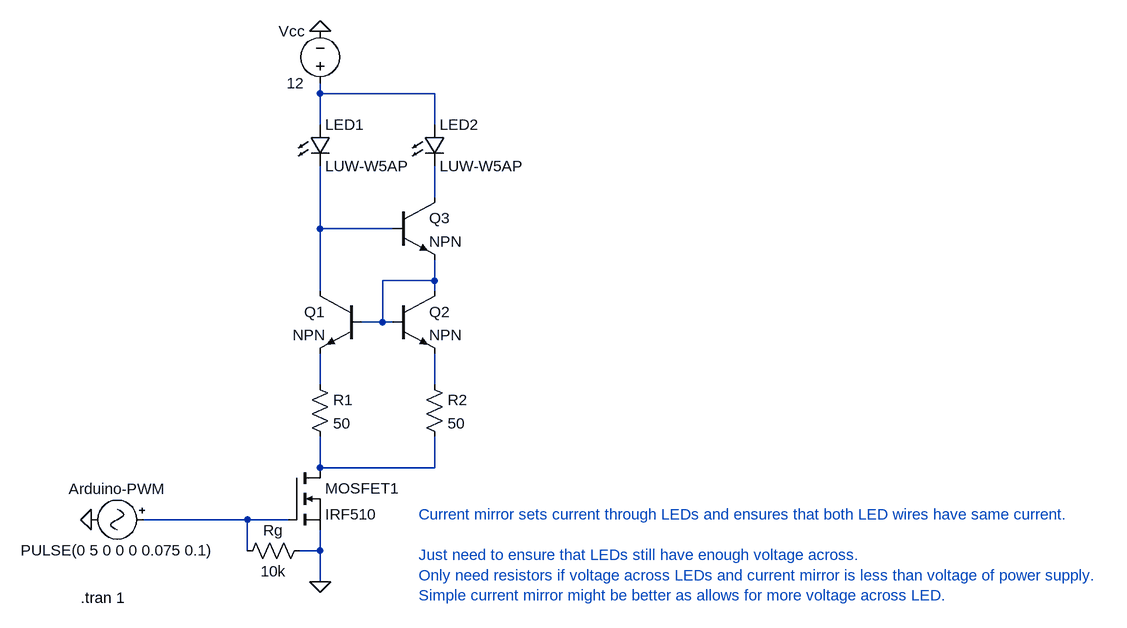
[diagram p0: schematic LED dimmer using MOSFET PWM - with current mirror.asc]
LED dimmer using MOSFET PWM - with current mirror.asc, the LTspice schematic file:
Version 4
SHEET 1 1616 680
WIRE 224 -464 224 -480
WIRE 400 -464 224 -464
WIRE 224 -416 224 -464
WIRE 400 -416 400 -464
WIRE 400 -304 400 -352
WIRE 224 -256 224 -352
WIRE 336 -256 224 -256
WIRE 400 -176 400 -208
WIRE 400 -176 320 -176
WIRE 224 -160 224 -256
WIRE 400 -160 400 -176
WIRE 320 -112 320 -176
WIRE 320 -112 288 -112
WIRE 336 -112 320 -112
WIRE 224 -16 224 -64
WIRE 400 -16 400 -64
WIRE 224 112 224 64
WIRE 400 112 400 64
WIRE 400 112 224 112
WIRE 112 192 -48 192
WIRE 176 192 112 192
WIRE 112 240 112 192
WIRE 224 240 224 208
WIRE 224 240 192 240
WIRE 224 288 224 240
FLAG 224 288 0
FLAG 224 -560 0
FLAG -128 192 0
SYMBOL nmos 176 112 R0
SYMATTR InstName MOSFET1
SYMATTR Value IRF510
SYMBOL voltage 224 -464 R180
WINDOW 0 24 96 Left 2
WINDOW 3 24 16 Left 2
SYMATTR InstName Vcc
SYMATTR Value 12
SYMBOL Misc\\signal -32 192 R90
WINDOW 0 -32 56 VBottom 2
WINDOW 3 32 56 VTop 2
WINDOW 123 0 0 Left 0
WINDOW 39 0 0 Left 0
SYMATTR InstName Arduino-PWM
SYMATTR Value PULSE(0 5 0 0 0 0.075 0.1)
SYMBOL res 208 224 R90
WINDOW 0 0 56 VBottom 2
WINDOW 3 32 56 VTop 2
SYMATTR InstName Rg
SYMATTR Value 10k
SYMBOL LED 208 -416 R0
SYMATTR InstName LED1
SYMATTR Value LUW-W5AP
SYMBOL LED 384 -416 R0
SYMATTR InstName LED2
SYMATTR Value LUW-W5AP
SYMBOL npn 288 -160 M0
SYMATTR InstName Q1
SYMBOL npn 336 -160 R0
SYMATTR InstName Q2
SYMBOL npn 336 -304 R0
SYMATTR InstName Q3
SYMBOL res 208 -32 R0
SYMATTR InstName R1
SYMATTR Value 50
SYMBOL res 384 -32 R0
SYMATTR InstName R2
SYMATTR Value 50
TEXT -144 312 Left 2 !.tran 1
TEXT 376 184 Left 2 ;Current mirror sets current through LEDs and ensures that both LED wires have same current.\n \nJust need to ensure that LEDs still have enough voltage across.\nOnly need resistors if voltage across LEDs and current mirror is less than voltage of power supply. \nSimple current mirror might be better as allows for more voltage across LED.

The netlist it stands for:
* LED dimmer using MOSFET PWM - with current mirror.asc
MOSFET1 N007 N008 0 0 IRF510
Vcc N001 0 12
V§Arduino-PWM N008 0 PULSE(0 5 0 0 0 0.075 0.1)
Rg 0 N008 10k
D§LED1 N001 N003 LUW-W5AP
D§LED2 N001 N002 LUW-W5AP
Q1 N003 N004 N005 0 NPN
Q2 N004 N004 N006 0 NPN
Q3 N002 N003 N004 0 NPN
R1 N005 N007 50
R2 N006 N007 50
.model D D
.lib standard.dio
.model NPN NPN
.model PNP PNP
.lib standard.bjt
.model NMOS NMOS
.model PMOS PMOS
.lib standard.mos
.tran 1
* Current mirror sets current through LEDs and ensures that both LED wires have same current.
* Just need to ensure that LEDs still have enough voltage across.
* Only need resistors if voltage across LEDs and current mirror is less than voltage of power supply.
* Simple current mirror might be better as allows for more voltage across LED.
.backanno
.end